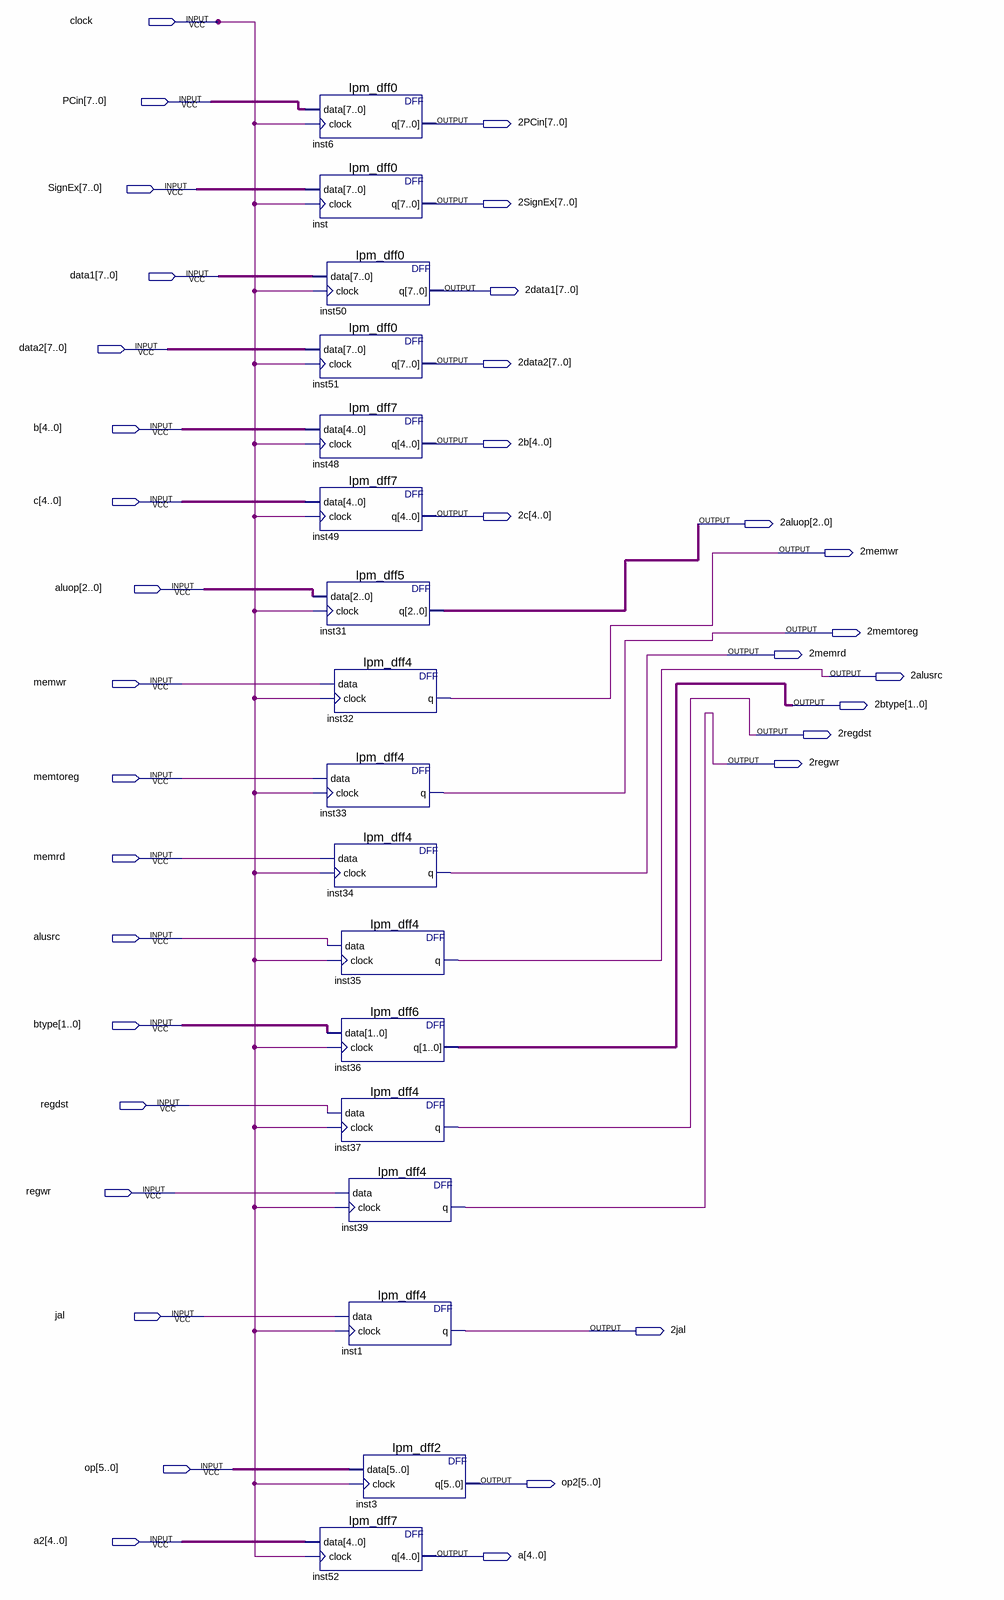
[diagram p0: schematic sheet]
// Quartus schematic ID_Ex.bdf as structural Verilog: 17 symbols, 35 pins
module ID_Ex (
  input  clock,
  input  [7:0] PCin,
  input  [7:0] SignEx,
  input  [7:0] data1,
  input  [7:0] data2,
  input  [4:0] b,
  input  [4:0] c,
  input  [2:0] aluop,
  input  memwr,
  input  memtoreg,
  input  memrd,
  input  alusrc,
  input  [1:0] btype,
  input  regdst,
  input  regwr,
  input  jal,
  input  [5:0] op,
  input  [4:0] a2,
  output [7:0] \2PCin ,
  output [7:0] \2SignEx ,
  output [7:0] \2data1 ,
  output [7:0] \2data2 ,
  output [4:0] \2b ,
  output [4:0] \2c ,
  output [2:0] \2aluop ,
  output \2memwr ,
  output \2memtoreg ,
  output \2memrd ,
  output \2alusrc ,
  output [1:0] \2btype ,
  output \2regdst ,
  output \2regwr ,
  output \2jal ,
  output [5:0] op2,
  output [4:0] a
);

  lpm_dff0 inst6 (.data(PCin), .clock(clock), .q(\2PCin ));
  lpm_dff0 inst (.data(SignEx), .clock(clock), .q(\2SignEx ));
  lpm_dff0 inst50 (.data(data1), .clock(clock), .q(\2data1 ));
  lpm_dff0 inst51 (.data(data2), .clock(clock), .q(\2data2 ));
  lpm_dff7 inst48 (.data(b), .clock(clock), .q(\2b ));
  lpm_dff7 inst49 (.data(c), .clock(clock), .q(\2c ));
  lpm_dff5 inst31 (.data(aluop), .clock(clock), .q(\2aluop ));
  lpm_dff4 inst32 (.data(memwr), .clock(clock), .q(\2memwr ));
  lpm_dff4 inst33 (.data(memtoreg), .clock(clock), .q(\2memtoreg ));
  lpm_dff4 inst34 (.data(memrd), .clock(clock), .q(\2memrd ));
  lpm_dff4 inst35 (.data(alusrc), .clock(clock), .q(\2alusrc ));
  lpm_dff6 inst36 (.data(btype), .clock(clock), .q(\2btype ));
  lpm_dff4 inst37 (.data(regdst), .clock(clock), .q(\2regdst ));
  lpm_dff7 inst52 (.data(a2), .clock(clock), .q(a));
  lpm_dff4 inst39 (.data(regwr), .clock(clock), .q(\2regwr ));
  lpm_dff4 inst1 (.data(jal), .clock(clock), .q(\2jal ));
  lpm_dff2 inst3 (.data(op), .clock(clock), .q(op2));
endmodule
